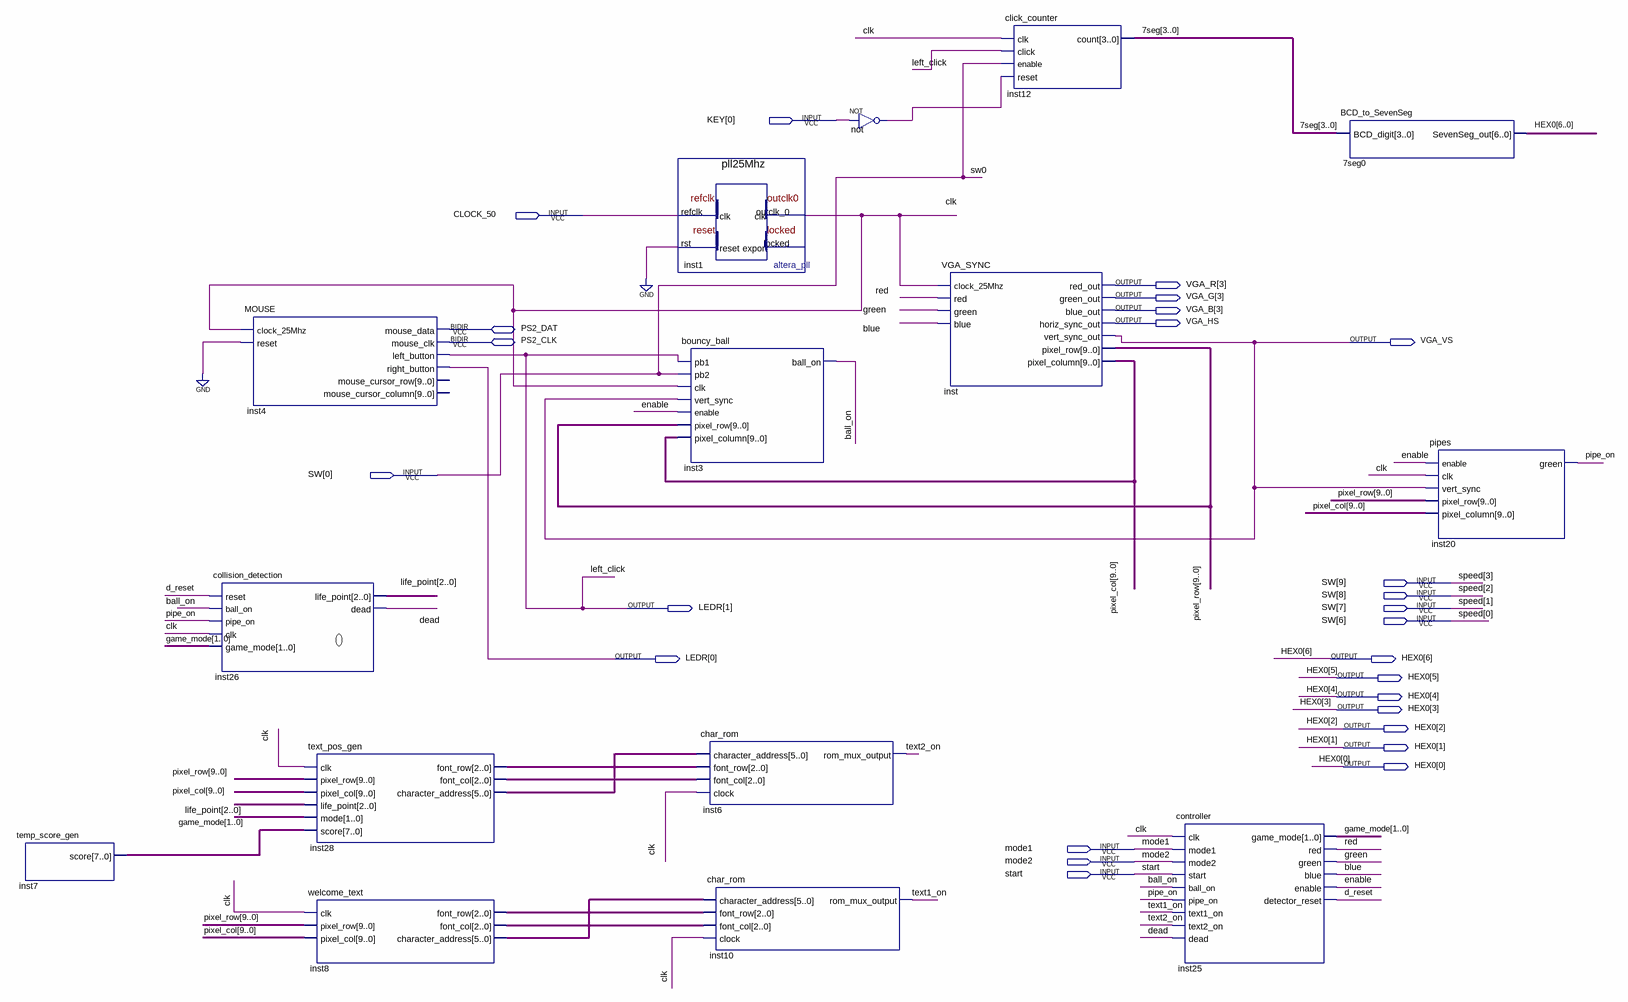
[diagram p0: schematic sheet]
// Quartus schematic vga_tester.bdf as structural Verilog: 15 symbols, 26 pins
module vga_tester (
  input  [0:0] KEY,
  input  CLOCK_50,
  input  [9:0] SW,
  input  mode1,
  input  mode2,
  input  start,
  inout  PS2_DAT,
  inout  PS2_CLK,
  output [3:3] VGA_R,
  output [3:3] VGA_G,
  output [3:3] VGA_B,
  output VGA_HS,
  output VGA_VS,
  output [1:0] LEDR,
  output [6:0] HEX0
);

  wire ball_on, blue, clk, d_reset, dead, enable, green, not_out, pipe_on, red, text1_on, text2_on;
  wire [1:0] game_mode;
  wire [2:0] inst8_font_col, inst8_font_row, inst28_font_col, inst28_font_row, life_point;
  wire [3:0] \7seg ;
  wire [5:0] inst8_character_address, inst28_character_address;
  wire [7:0] inst7_score;
  wire [9:0] pixel_col, pixel_row;

  temp_score_gen inst7 (.score(inst7_score));
  collision_detection inst26 (
    .reset(d_reset), .ball_on(ball_on), .pipe_on(pipe_on), .clk(clk), .game_mode(game_mode),
    .life_point(life_point), .dead(dead));
  MOUSE inst4 (
    .clock_25Mhz(clk), .reset(1'b0), .left_button(LEDR[1]), .right_button(LEDR[0]), .mouse_data(PS2_DAT),
    .mouse_clk(PS2_CLK));  // open: mouse_cursor_row, mouse_cursor_column
  text_pos_gen inst28 (
    .clk(clk), .pixel_row(pixel_row), .pixel_col(pixel_col), .life_point(life_point), .mode(game_mode),
    .score(inst7_score), .font_row(inst28_font_row), .font_col(inst28_font_col),
    .character_address(inst28_character_address));
  welcome_text inst8 (
    .clk(clk), .pixel_row(pixel_row), .pixel_col(pixel_col), .font_row(inst8_font_row),
    .font_col(inst8_font_col), .character_address(inst8_character_address));
  pll25Mhz inst1 (.refclk(CLOCK_50), .rst(1'b0), .outclk_0(clk));  // open: locked
  bouncy_ball inst3 (
    .pb1(LEDR[1]), .pb2(SW[0]), .clk(clk), .vert_sync(VGA_VS), .enable(enable), .pixel_row(pixel_row),
    .pixel_column(pixel_col), .ball_on(ball_on));
  char_rom inst6 (
    .character_address(inst28_character_address), .font_row(inst28_font_row), .font_col(inst28_font_col),
    .clock(clk), .rom_mux_output(text2_on));
  char_rom inst10 (
    .character_address(inst8_character_address), .font_row(inst8_font_row), .font_col(inst8_font_col),
    .clock(clk), .rom_mux_output(text1_on));
  not \not  (not_out, KEY[0]);
  VGA_SYNC inst (
    .clock_25Mhz(clk), .red(red), .green(green), .blue(blue), .red_out(VGA_R[3]), .green_out(VGA_G[3]),
    .blue_out(VGA_B[3]), .horiz_sync_out(VGA_HS), .vert_sync_out(VGA_VS), .pixel_row(pixel_row),
    .pixel_column(pixel_col));
  click_counter inst12 (.clk(clk), .click(LEDR[1]), .enable(SW[0]), .reset(not_out), .count(\7seg ));
  controller inst25 (
    .clk(clk), .mode1(mode1), .mode2(mode2), .start(start), .ball_on(ball_on), .pipe_on(pipe_on),
    .text1_on(text1_on), .text2_on(text2_on), .dead(dead), .game_mode(game_mode), .red(red), .green(green),
    .blue(blue), .enable(enable), .detector_reset(d_reset));
  BCD_to_SevenSeg u_7seg0 (.BCD_digit(\7seg ), .SevenSeg_out(HEX0));
  pipes inst20 (
    .enable(enable), .clk(clk), .vert_sync(VGA_VS), .pixel_row(pixel_row), .pixel_column(pixel_col),
    .green(pipe_on));

  // Other names for the same wires on the sheet: left_click = LEDR[1]; speed[3:0] = SW[9:6]
endmodule
